# Altium schematic sheet Sheet2.SchDoc
size A4; SheetNumber: 2; SheetTotal: 3
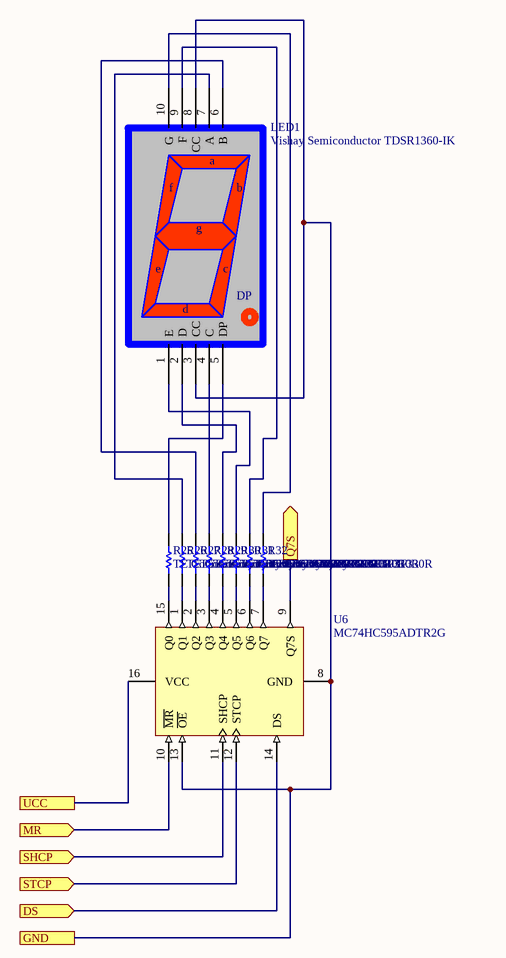
[diagram p0: Sheet2.SchDoc]

## Parts
LED1  Vishay Semiconductor TDSR1360-IK  [PCB-wjfw9shywxa82n8451hf-1]
R25  TE Connectivity CRG0603F330R  [RESC1608X55X30NL15T15]
R26  TE Connectivity CRG0603F330R  [RESC1608X55X30NL15T15]
R27  TE Connectivity CRG0603F330R  [RESC1608X55X30NL15T15]
R28  TE Connectivity CRG0603F330R  [RESC1608X55X30NL15T15]
R29  TE Connectivity CRG0603F330R  [RESC1608X55X30NL15T15]
R30  TE Connectivity CRG0603F330R  [RESC1608X55X30NL15T15]
R31  TE Connectivity CRG0603F330R  [RESC1608X55X30NL15T15]
R32  TE Connectivity CRG0603F330R  [RESC1608X55X30NL15T15]
U6  MC74HC595ADTR2G  [MC74HC595ADTR2G-Footprint-1]

## Ports
DS (in), GND, MR (in), Q7S (out), SHCP (in), STCP (in), UCC

## Nets
DS: U6.14(DS) ; port DS
GND: LED1.3(CC) LED1.8(CC) U6.8(GND) U6.13(~{OE}) ; port GND
MR: U6.10(~{MR}) ; port MR
Q7S: U6.9(Q7S) ; port Q7S
SHCP: U6.11(SHCP) ; port SHCP
STCP: U6.12(STCP) ; port STCP
UCC: U6.16(VCC) ; port UCC
NetLED1_1: LED1.1(E) R30.2
NetLED1_2: LED1.2(D) R29.2
NetLED1_4: LED1.4(C) R28.2
NetLED1_5: LED1.5(DP) R25.2
NetLED1_6: LED1.6(B) R27.2
NetLED1_7: LED1.7(A) R26.2
NetLED1_9: LED1.9(F) R31.2
NetLED1_10: LED1.10(G) R32.2
NetR25_1: R25.1 U6.15(Q0)
NetR26_1: R26.1 U6.1(Q1)
NetR27_1: R27.1 U6.2(Q2)
NetR28_1: R28.1 U6.3(Q3)
NetR29_1: R29.1 U6.4(Q4)
NetR30_1: R30.1 U6.5(Q5)
NetR31_1: R31.1 U6.6(Q6)
NetR32_1: R32.1 U6.7(Q7)

## Notes on the sheet
- (in symbol CMP-f4ae3c33d6e22b69-5) a; f; b; g; e; c; d

## Library data of the parts
LED1 = CMP-f4ae3c33d6e22b69-5: Displays Dot Matrix Module 1DIGIT 8LED Red 10-Pin DIP Tube; Luminous Intensity: 3.60 mcd; Character Size-Height: 13.0 mm; Forward Voltage: 1.80 V; Octopart URL: http://octopart.com/tdsr1360-ik-vishay+semiconductor-26674986; Color: Red; OctopartID: f4ae3c33d6e22b69; Manufacturer Part Number: TDSR1360-IK; RoHS: Compliant; Case/Package: DIP
R25-R32 = CMP-139fda6064c8cc58-2: Res Thick Film 0603 330 Ohm 1% 0.1W(1/10W) ±100ppm/C Pad SMD T/R; ELV Compliant: Compliant; Resistance: 330 Ω; Power Rating: 100 mW; Manufacturer Part Number: CRG0603F330R; Footprint: PCB-0002-00066-3; RoHS: Compliant; Mounting Style: Surface Mount; Lifecycle Status: Active; Case/Package: 0603; OctopartID: 139fda6064c8cc58; Packaging: Tape & Reel (TR); Octopart URL: https://octopart.com/crg0603f330r-te+connectivity-16077361
U6 = CMP-ba6473693a2065a3-3: Shift Shift Register 1 Element 8 Bit 16-TSSOP; OctopartID: ba6473693a2065a3